# Altium schematic sheet mixer-tx.SchDoc: TX Mixer
size Letter; CheckedBy: J. Brinton; CompanyName: Signal Laboratories, Inc.; DrawnBy: J. Brinton; Engineer: J. Brinton; Address1: 3479 Edison Way; Address2: Menlo Park CA 94025; Address3: +1 (877) 778-8435; Address4: siglabs.com; Revision: 3; SheetNumber: 6; SheetTotal: 49
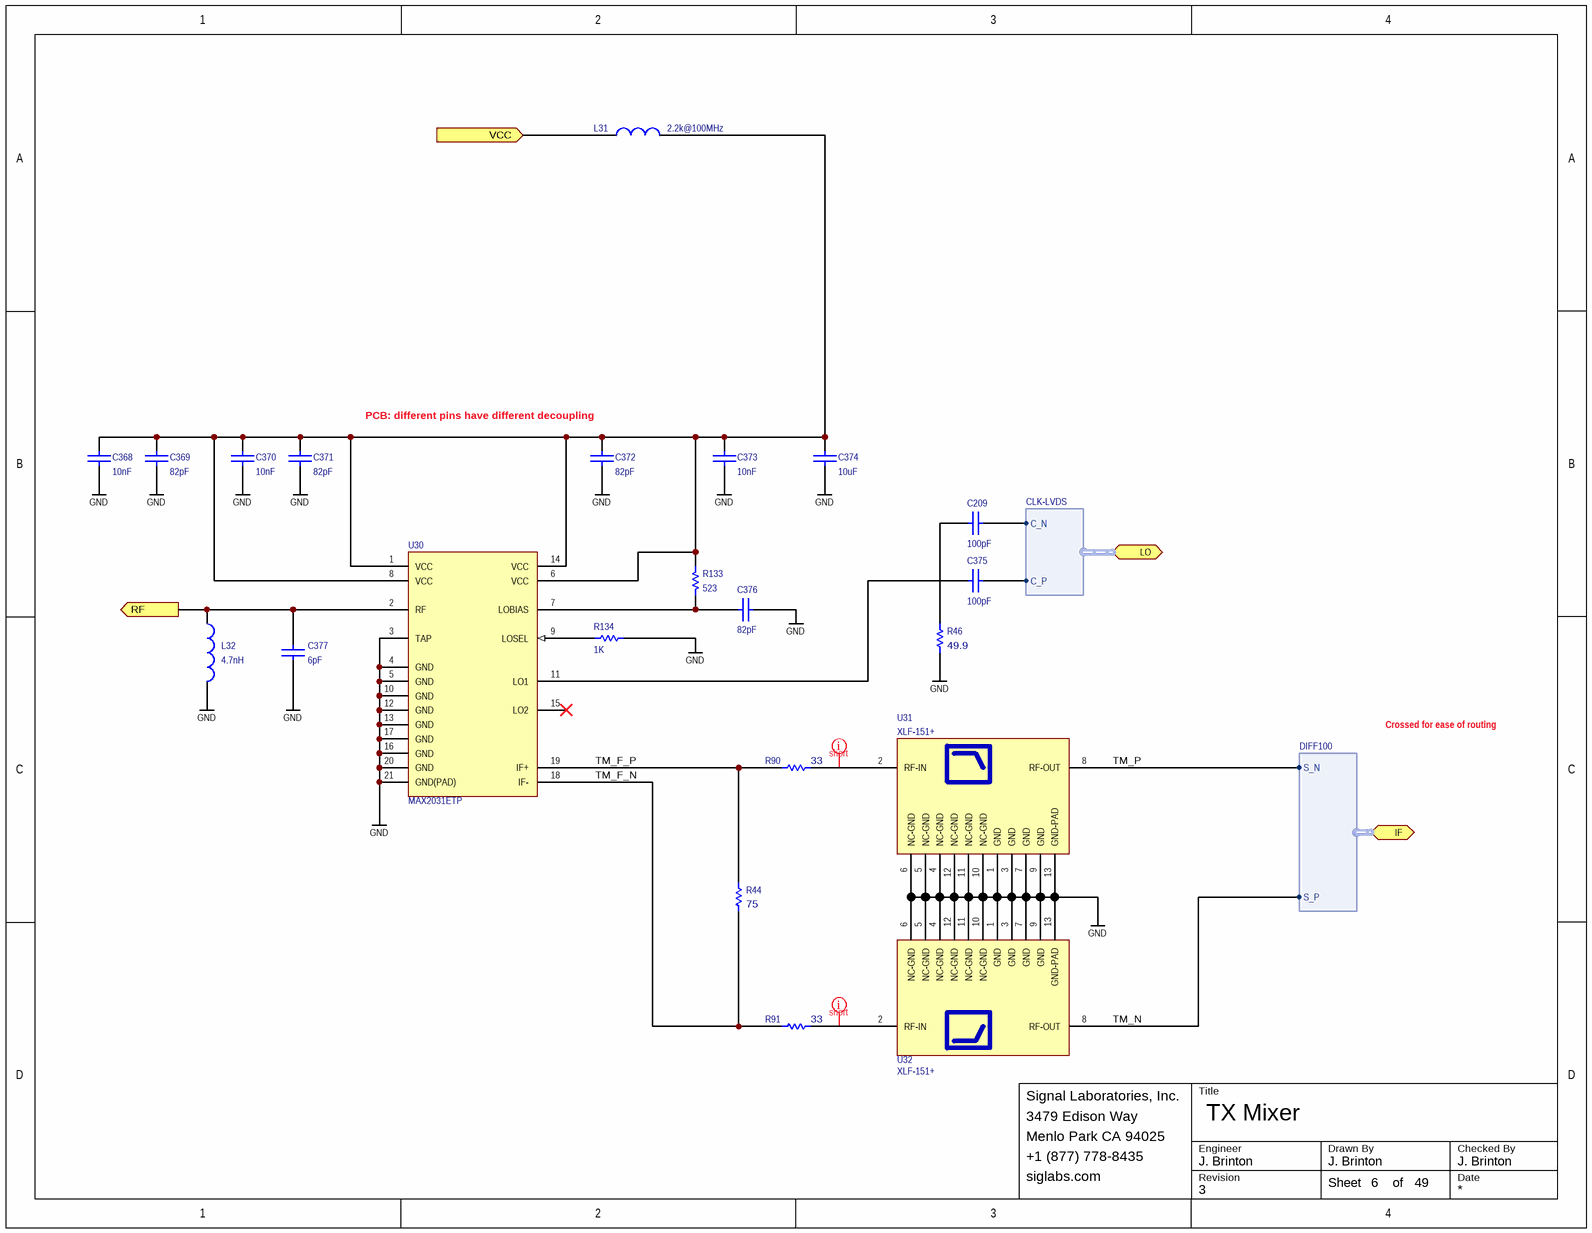
[diagram p0: mixer-tx.SchDoc]

## Parts
C209  value 100pF  [CAPC100X50X55L25N]  (hidden comment: CBR04C101F3GAC)
C368  value 10nF  [CAPC100X50X55L25N]  (hidden comment: GRM155R71H103KA88)
C369  value 82pF  [CAPC100X50X55L25N]  (hidden comment: VJ0402D820JXXAJ)
C370  value 10nF  [CAPC100X50X55L25N]  (hidden comment: GRM155R71H103KA88)
C371  value 82pF  [CAPC100X50X55L25N]  (hidden comment: VJ0402D820JXXAJ)
C372  value 82pF  [CAPC100X50X55L25N]  (hidden comment: VJ0402D820JXXAJ)
C373  value 10nF  [CAPC100X50X55L25N]  (hidden comment: GRM155R71H103KA88)
C374  value 10uF  [CAPC160X80X90L20N]  (hidden comment: ZRB18AR61E106ME01L)
C375  value 100pF  [CAPC100X50X55L25N]  (hidden comment: CBR04C101F3GAC)
C376  value 82pF  [CAPC100X50X55L25N]  (hidden comment: VJ0402D820JXXAJ)
C377  value 6pF  [CAPC100X50X55L25N]  (hidden comment: GJM1555C1H6R0CB01D)
L31  value 2.2k@100MHz  [INDC1005X55N]  (hidden comment: MMZ1005A222ET000)
L32  value 4.7nH  [0603]  (hidden comment: LQG18HN4N7S00D)
R44  value 75  [RESC1608X55N]  (hidden comment: MCT0603MD7509BP100)
R46  value 49.9  [RESC1608X55N]  (hidden comment: MCT0603PD4999DP500)
R90  value 33  [RESC1005X40N]  (hidden comment: MCS04020C3309FE000)
R91  value 33  [RESC1005X40N]  (hidden comment: MCS04020C3309FE000)
R133  value 523  [RESC1005X40N]  (hidden comment: ERA-2AEB5230X)
R134  value 1K  [RESC1005X40N]  (hidden comment: RC0402FR-071KL)
U30  MAX2031ETP  [QFN21P65_500X500X80L55X30T320N]
U31  XLF-151+  [QFN-XLF-12]
U32  XLF-151+  [QFN-XLF-12]

## Ports
IF (harness DIFF100), LO (harness CLK-LVDS), RF (out), VCC (in)

## Harnesses
CLK-LVDS: C_P, C_N
DIFF100: S_P, S_N

## Nets
GND: C368.1 C369.1 C370.1 C371.1 C372.1 C373.1 C374.1 C376.2 C377.1 L32.1 R46.1 R134.2 U30.3(TAP) U30.4(GND) U30.5(GND) U30.10(GND) U30.12(GND) U30.13(GND) U30.16(GND) U30.17(GND) U30.20(GND) U30.21(GND(PAD)) U31.1(GND) U31.3(GND) U31.4(NC-GND) U31.5(NC-GND) U31.6(NC-GND) U31.7(GND) U31.9(GND) U31.10(NC-GND) U31.11(NC-GND) U31.12(NC-GND) U31.13(GND-PAD) U32.1(GND) U32.3(GND) U32.4(NC-GND) U32.5(NC-GND) U32.6(NC-GND) U32.7(GND) U32.9(GND) U32.10(NC-GND) U32.11(NC-GND) U32.12(NC-GND) U32.13(GND-PAD)
RF: C377.2 L32.2 U30.2(RF) ; port RF
TM_F_N: R44.1 R91.2 U30.18(IF-)
TM_F_P: R44.2 R90.2 U30.19(IF+)
TM_N: U32.8(RF-OUT) ; port IF.S_P
TM_P: U31.8(RF-OUT) ; port IF.S_N
VCC: L31.1 ; port VCC
NetC209_1: C209.1 R46.2
NetC209_2: C209.2 ; port LO.C_N
NetC368_2: C368.2 C369.2 C370.2 C371.2 C372.2 C373.2 C374.2 L31.2 R133.2 U30.1(VCC) U30.6(VCC) U30.8(VCC) U30.14(VCC)
NetC375_1: C375.1 U30.11(LO1)
NetC375_2: C375.2 ; port LO.C_P
NetC376_1: C376.1 R133.1 U30.7(LOBIAS)
NetR90_1: R90.1 U31.2(RF-IN)
NetR91_1: R91.1 U32.2(RF-IN)
NetR134_1: R134.1 U30.9(LOSEL)

Not connected (* = marked no-connect by the designer): U30 15(LO2)*

## Layout directives
net class short: NetR90_1, NetR91_1

## Notes on the sheet
- (near C372) PCB: different pins have different decoupling
- Crossed for ease of routing
- Title
- Engineer
- Revision
- Drawn By
- Checked By
- Date
- Sheet
- of

## Library data of the parts
C209 C375 = CAP 0603: Ceramic Capacitor 100pF ±1% 25V NP0 0402; Manufacturer: Kemet; Tr: -55:125; Voltage: 25V; Manufacturer P/N: CBR04C101F3GAC; Package: 0402; Tolerance: ±1%
C368 C370 C373 = CAP 0402: Ceramic Capacitor 10nF ±10% 50V X7R 0402; Manufacturer: Murata; Tr: -55:125; Voltage: 50V; Manufacturer P/N: GRM155R71H103KA88; Package: 0402; Tolerance: ±10%
C369 C371 C372 C376 = CAP: Ceramic Capacitor 82pF ±5% 25V NP0 0402; Manufacturer: Vishay; Tr: 55:125; Manufacturer P/N: VJ0402D820JXXAJ; Voltage: 25V; Tolerance: ±5%; Footprint: *; Package: 0402
C374 = CAP 0603: Ceramic Capacitor 10uF ±20% 25V X5R 0603; Manufacturer: Murata; Tr: -55:85; Manufacturer P/N: ZRB18AR61E106ME01L; Voltage: 25V; Package: 0603; Tolerance: ±20%
C377 = CAP 0402: Ceramic Capacitor 6pF ±0.25pF 50V NP0 RF 0402; Manufacturer: Murata; Tr: -55:125; Voltage: 50V; Manufacturer P/N: GJM1555C1H6R0CB01D; Package: 0402; Tolerance: ±0.25pF
L31 = INDUCTANCE1: Ferrite Bead 2.2k@100MHz 150mA 0402; Manufacturer: TDK; Tr: -55:125; Manufacturer P/N: MMZ1005A222ET000; Package: 0402
L32 = IND 0603: Inductor 4.7nH ±0.3nH 0603; Manufacturer: Murata; Tr: -55:125; Manufacturer P/N: LQG18HN4N7S00D; Package: 0603; Tolerance: ±0.3nH
R44 = RES 0603: Thin Film Resistor 75 Ohm ±0.1% 0603; Manufacturer: Vishay; Tr: -55:155; Package: 0603; Manufacturer P/N: MCT0603MD7509BP100; Do Not Place: *; Tolerance: ±0.1%
R46 = RES 0603: Thin Film Resistor 49.9 Ohm ±0.5% 0603; Manufacturer: Vishay; Tr: -55:155; Package: 0603; Manufacturer P/N: MCT0603PD4999DP500; Do Not Place: *; Tolerance: ±0.5%
R90 R91 = RES 0603: Thin Film Resistor 33 Ohm ±1% 0402; Manufacturer: Vishay; Tr: -55:155; Package: 0402; Manufacturer P/N: MCS04020C3309FE000; Do Not Place: *; Tolerance: ±1%
R133 = RES 0402: Thin Film Resistor 523 ±0.1% 0402; Manufacturer: Panasonic; Tr: -55:155; Package: 0402; Manufacturer P/N: ERA-2AEB5230X; Tolerance: ±0.1%
R134 = RES 0402: Thick Film Resistor 1k ±1% 0402; Manufacturer: Yageo; Tr: -55:155; Package: 0402; Manufacturer P/N: RC0402FR-071KL; Do Not Place: *; Tolerance: ±1%
U30 = MAX2031ETP: Upconversion/Downconversion Mixer; Manufacturer: Maxim; Manufacturer P/N: MAX2031ETP
U31 U32 = XLF-151+: Reflectionless Low-Pass Filter, DC-150Mhz; Manufacturer: Mini-Circuits; Manufacturer P/N: XLF-151+